# EAGLE design fonte_de_tensao (EAGLE 9.6.2)
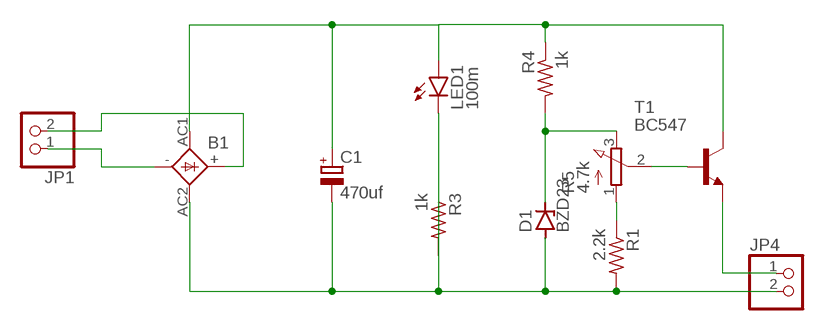
[diagram p0: schematic, sheet 1]

## Parts
B1  1KAB  [1KAB]
C1  470uf  CPOL-EUE3.5-10  [E3,5-10]
D1  BZD23  [SOD81]
JP1  PINHD-1X2  [1X02]
JP4  PINHD-1X2  [1X02]
LED1  100m  LED5MM  [LED5MM]
R1  2.2k  R-US_0309/12  [0309/12]
R3  1k  R-US_0309/12  [0309/12]
R4  1k  R-US_0309/12  [0309/12]
R5  4.7k  3RP/1610N  [3RP/1610N]
T1  BC547  [TO92]

## Nets
N$1: B1.- JP1.1
N$2: JP4.1 T1.1(E)
N$4: B1.+ JP1.2
N$5: B1.AC2 C1.- D1.A JP4.2 R1.2 R3.1
N$6: B1.AC1 C1.+ LED1.A R4.1 T1.3(C)
N$7: R1.1 R5.1(A)
N$8: LED1.K(C) R3.2
N$9: D1.C R4.2 R5.3(E)
N$11: R5.2(S) T1.2(B)

## Library data of the parts
B1 = rectifier:1KAB: RECTIFIER grid 5,08 x 5,08 mm
C1 = rcl:CPOL-EU: POLARIZED CAPACITOR, European symbol; SPICEPREFIX: C
D1 = diode:BZD23: Z DIODE
JP1 JP4 = pinhead:PINHD-1X2: PIN HEADER
LED1 = led:LED: LED OSRAM: - CHIPLED LG R971, LG N971, LY N971, LG Q971, LY Q971, LO R971, LY R971 LH N974, LH R974 LS Q976, LO Q976, LY Q976 LO Q996 - Hyper CHIPLED LW Q18S LB Q993, LB Q99A, LB R99A - SideLED LS A670, LO A670, LY A670, LG A670, LP A670 LB A673, LV A673, LT A673, LW A673 LH A674 LY A675 LS A676, LA A676, LO A676, LY A676, LW A676 LS A679, LY A679, LG A679 - Hyper Micro SIDELED® LS Y876, LA Y876, LO Y876, LY Y876 LT Y87S - SmartLED LW L88C, LW L88S LB L89C, LB L89S, LG L890 LS L89K, LO L89K, LY L89K LS L896, LA L896, LO L896, LY L896 - TOPLED LS T670, LO T670, LY T670, LG T670, LP T670 LSG T670, LSP T670, LSY T670, LOP T670, LYG T670 LG T671, LOG T671, LSG T671 LB T673, LV T673, LT T673, LW T673 LH T674 LS T676, LA T676, LO T676, LY T676, LB T676, LH T676, LSB T676, LW T676 LB T67C, LV T67C, LT T67C, LS T67K, LO T67K, LY T67K, LW E67C LS E67B, LA E67B, LO E67B, LY E67B, LB E67C, LV E67C, LT E67C LW T67C LS T679, LY T679, LG T679 LS T770, LO T770, LY T770, LG T770, LP T770 LB T773, LV T773, LT T773, LW T773 LH T774 LS E675, LA E675, LY E675, LS T675 LS T776, LA T776, LO T776, LY T776, LB T776 LHGB T686 LT T68C, LB T68C - Hyper Mini TOPLED® LB M676 - Mini TOPLED Santana® LG M470 LS M47K, LO M47K, LY M47K Source: http://www.osram.convergy.de LUXEON: - LUMILED® LXK2-PW12-R00, LXK2-PW12-S00, LXK2-PW14-U00, LXK2-PW14-V00 LXK2-PM12-R00, LXK2-PM12-S00, LXK2-PM14-U00 LXK2-PE12-Q00, LXK2-PE12-R00, LXK2-PE12-S00, LXK2-PE14-T00, LXK2-PE14-U00 LXK2-PB12-K00, LXK2-PB12-L00, LXK2-PB12-M00, LXK2-PB14-N00, LXK2-PB14-P00, LXK2-PB14-Q00 LXK2-PR12-L00, LXK2-PR12-M00, LXK2-PR14-Q00, LXK2-PR14-R00 LXK2-PD12-Q00, LXK2-PD12-R00, LXK2-PD12-S00 LXK2-PH12-R00, LXK2-PH12-S00 LXK2-PL12-P00, LXK2-PL12-Q00, LXK2-PL12-R00 Source: www.luxeon.com KINGBRIGHT: KA-3528ASYC Source: www.kingbright.com
R1 R3 R4 = rcl:R-US_: RESISTOR, American symbol; SPICEPREFIX: R
R5 = pot:3RP/1610N: 16mm Potentiometer one level Source: http://www.alphapotentiometers.net/html/16mm_pot_2.html
T1 = transistor:BC547: NPN TRANSISTOR

## Board
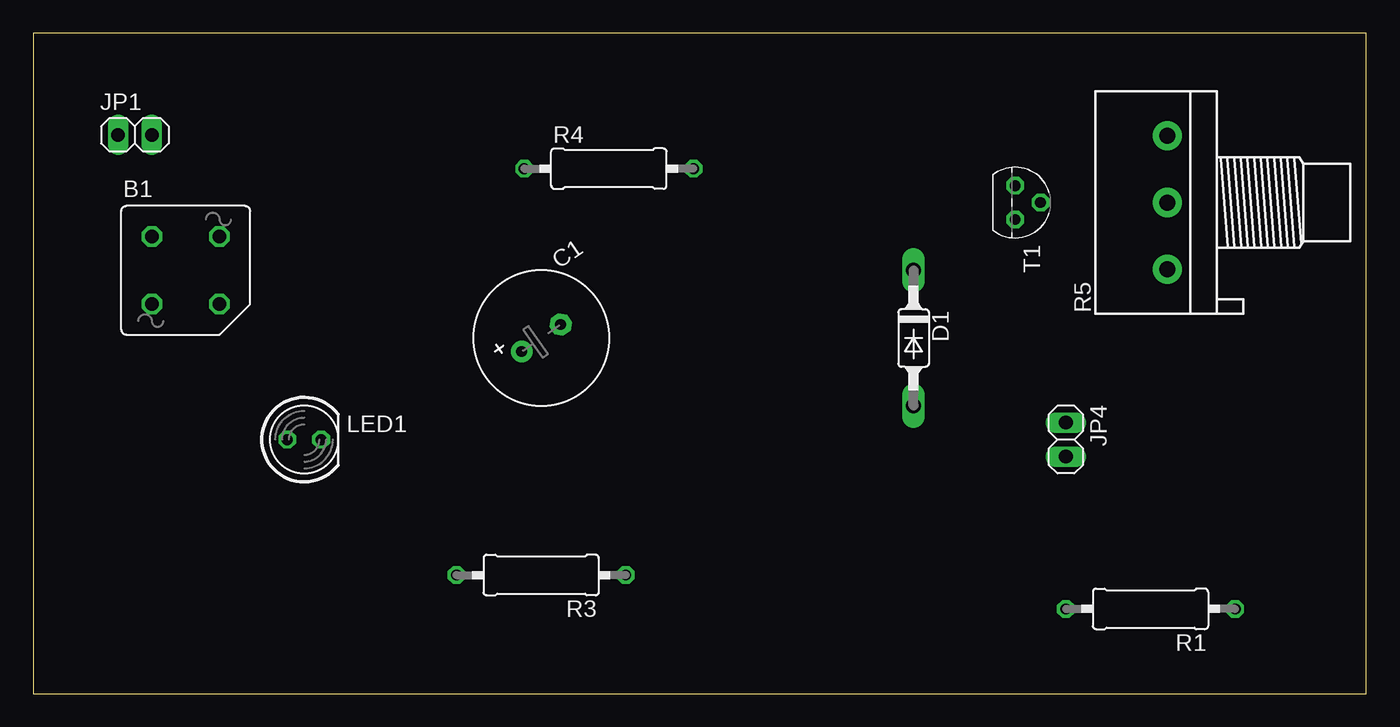
[diagram p1: board, top side]
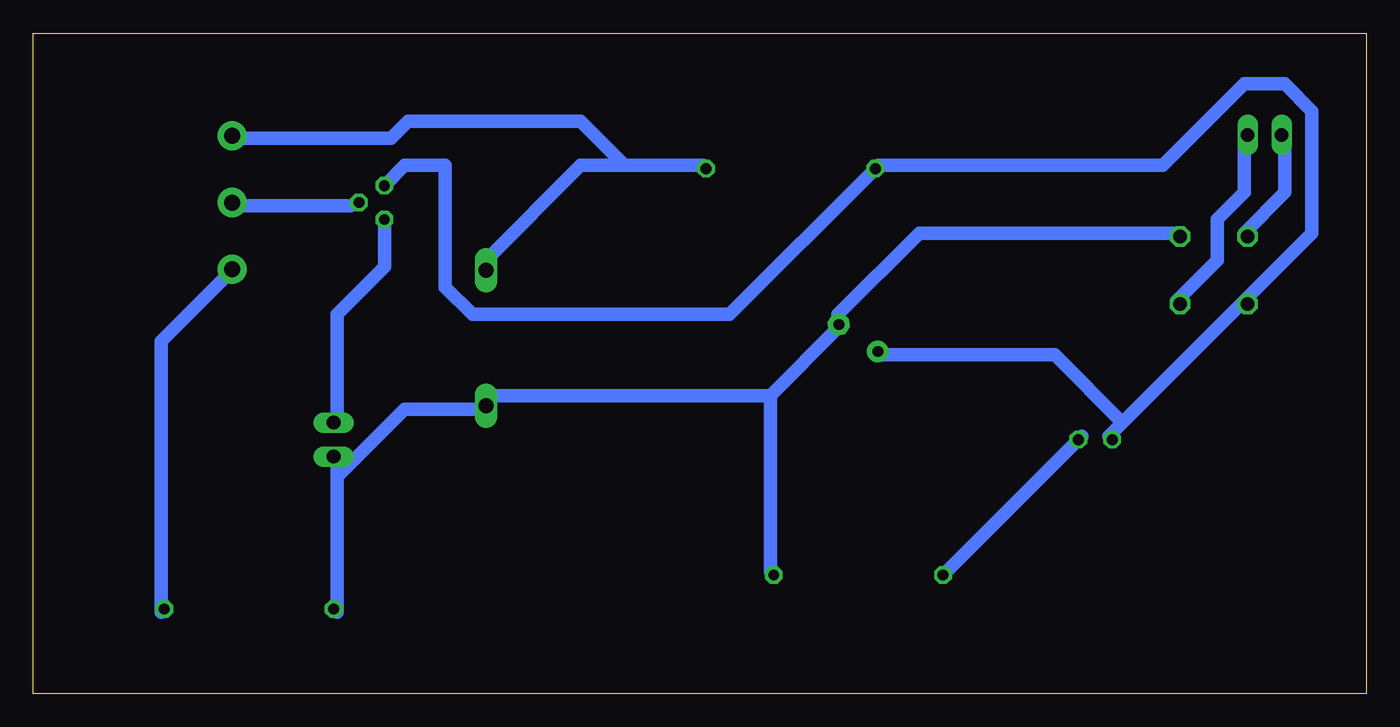
[diagram p2: board, bottom side, seen from below]

Size 100 x 49.52 mm. Coordinates in mm from the lower left corner, seen from the top.
Outline: 0,0 100,0 100,49.52 0,49.52 0,0
Copper layers (1*16): Top 0.035mm / dielectric 1.5mm / Bottom 0.035mm
Design rules "default *": minimum track width 40mil, minimum drill 0.35mm, track to track 40mil, track to pad 40mil, pad to pad 40mil, via to via 40mil, smd to smd 6mil, copper to edge 40mil, drill to drill 6mil, minimum pad ring 10mil, minimum via ring 8mil, stop-mask expansion 4mil, vias tented up to drill 0mil, thermal gap 10mil

### Footprints (pad centres in the part's own frame; a part is rotated, then mirrored left to right if it is on the bottom)
1KAB = drill 1.016 octagon: + 2.54,-2.54; - -2.54,2.54; AC1 -2.54,-2.54; AC2 2.54,2.54
E3,5-10 = drill 0.813 pad 1.6: + -1.778,0 | drill 0.813 pad 1.6 octagon: - 1.778,0
SOD81 = drill 1.118 long: A 5.08,0; C -5.08,0
1X02 = drill 1.016 long: 1 -1.27,0; 2 1.27,0
LED5MM = drill 0.813 octagon: A -1.27,0; K 1.27,0
0309/12 = drill 0.813 octagon: 1 -6.35,0; 2 6.35,0
3RP/1610N = drill 1.2 pad 2.184: 1 -5,0; 2 0,0; 3 5,0
TO92 = drill 0.813 octagon: 1 1.27,0; 2 0,1.905; 3 -1.27,0

### Placement (x,y rotation side)
B1  11.43,31.75 0 top
C1  38.1,26.67 34.7 top
D1  66.04,26.67 270 top
JP1  7.62,41.91 0 top
JP4  77.47,19.05 270 top
LED1  20.32,19.05 0 top
R1  83.82,6.35 180 top
R3  38.1,8.89 180 top
R4  43.18,39.37 0 top
R5  85.09,36.83 90 top
T1  73.66,36.83 270 top

### Tracks (layer width: path | path; a pad name or v marks a point on that pad's centre or on a via)
N$1
  Bottom 1.016: JP1.1 6.1,41.66 6.1,37.59 9.14,34.54 B1.-
N$2
  Bottom 1.016: T1.1 73.66,32 77.22,28.45 77.22,20.32 JP4.1
N$4
  Bottom 1.016: JP1.2 9.14,41.66 9.14,37.59 11.18,35.56 11.18,32.51 14.22,29.46 B1.+
N$5
  Bottom 1.016: 77.22,16.26 77.22,17.27 JP4.2 | 77.22,16.26 77.22,6.1 R1.2 | 77.22,16.26 72.14,21.34 66.04,21.34 D1.A 66.04,22.35 44.7,22.35 | 44.7,22.35 44.7,9.14 R3.1 | 44.7,22.35 39.62,27.43 C1.- 39.62,28.45 33.53,34.54 14.22,34.54 B1.AC2
N$6
  Bottom 1.016: 9.14,29.46 18.29,20.32 | 18.29,20.32 19.3,19.3 LED1.A | 9.14,29.46 4.06,34.54 4.06,43.69 6.1,45.72 9.14,45.72 15.24,39.62 36.58,39.62 R4.1 47.75,28.45 67.06,28.45 69.09,30.48 69.09,39.62 72.14,39.62 T1.3 | 9.14,29.46 B1.AC1 | 18.29,20.32 23.37,25.4 36.58,25.4 C1.+
N$7
  Bottom 1.016: R1.1 90.42,6.1 90.42,26.42 85.34,31.5 R5.1
N$8
  Bottom 1.016: R3.2 LED1.K 21.34,19.3
N$9
  Bottom 1.016: 55.63,39.62 58.93,39.62 66.04,32.51 D1.C | 55.63,39.62 49.78,39.62 R4.2 | 55.63,39.62 58.93,42.93 71.88,42.93 73.15,41.66 84.33,41.66 R5.3
N$11
  Bottom 1.016: T1.2 76.2,36.58 84.33,36.58 R5.2